# Altium schematic sheet Project 2.SchDoc
size Tabloid
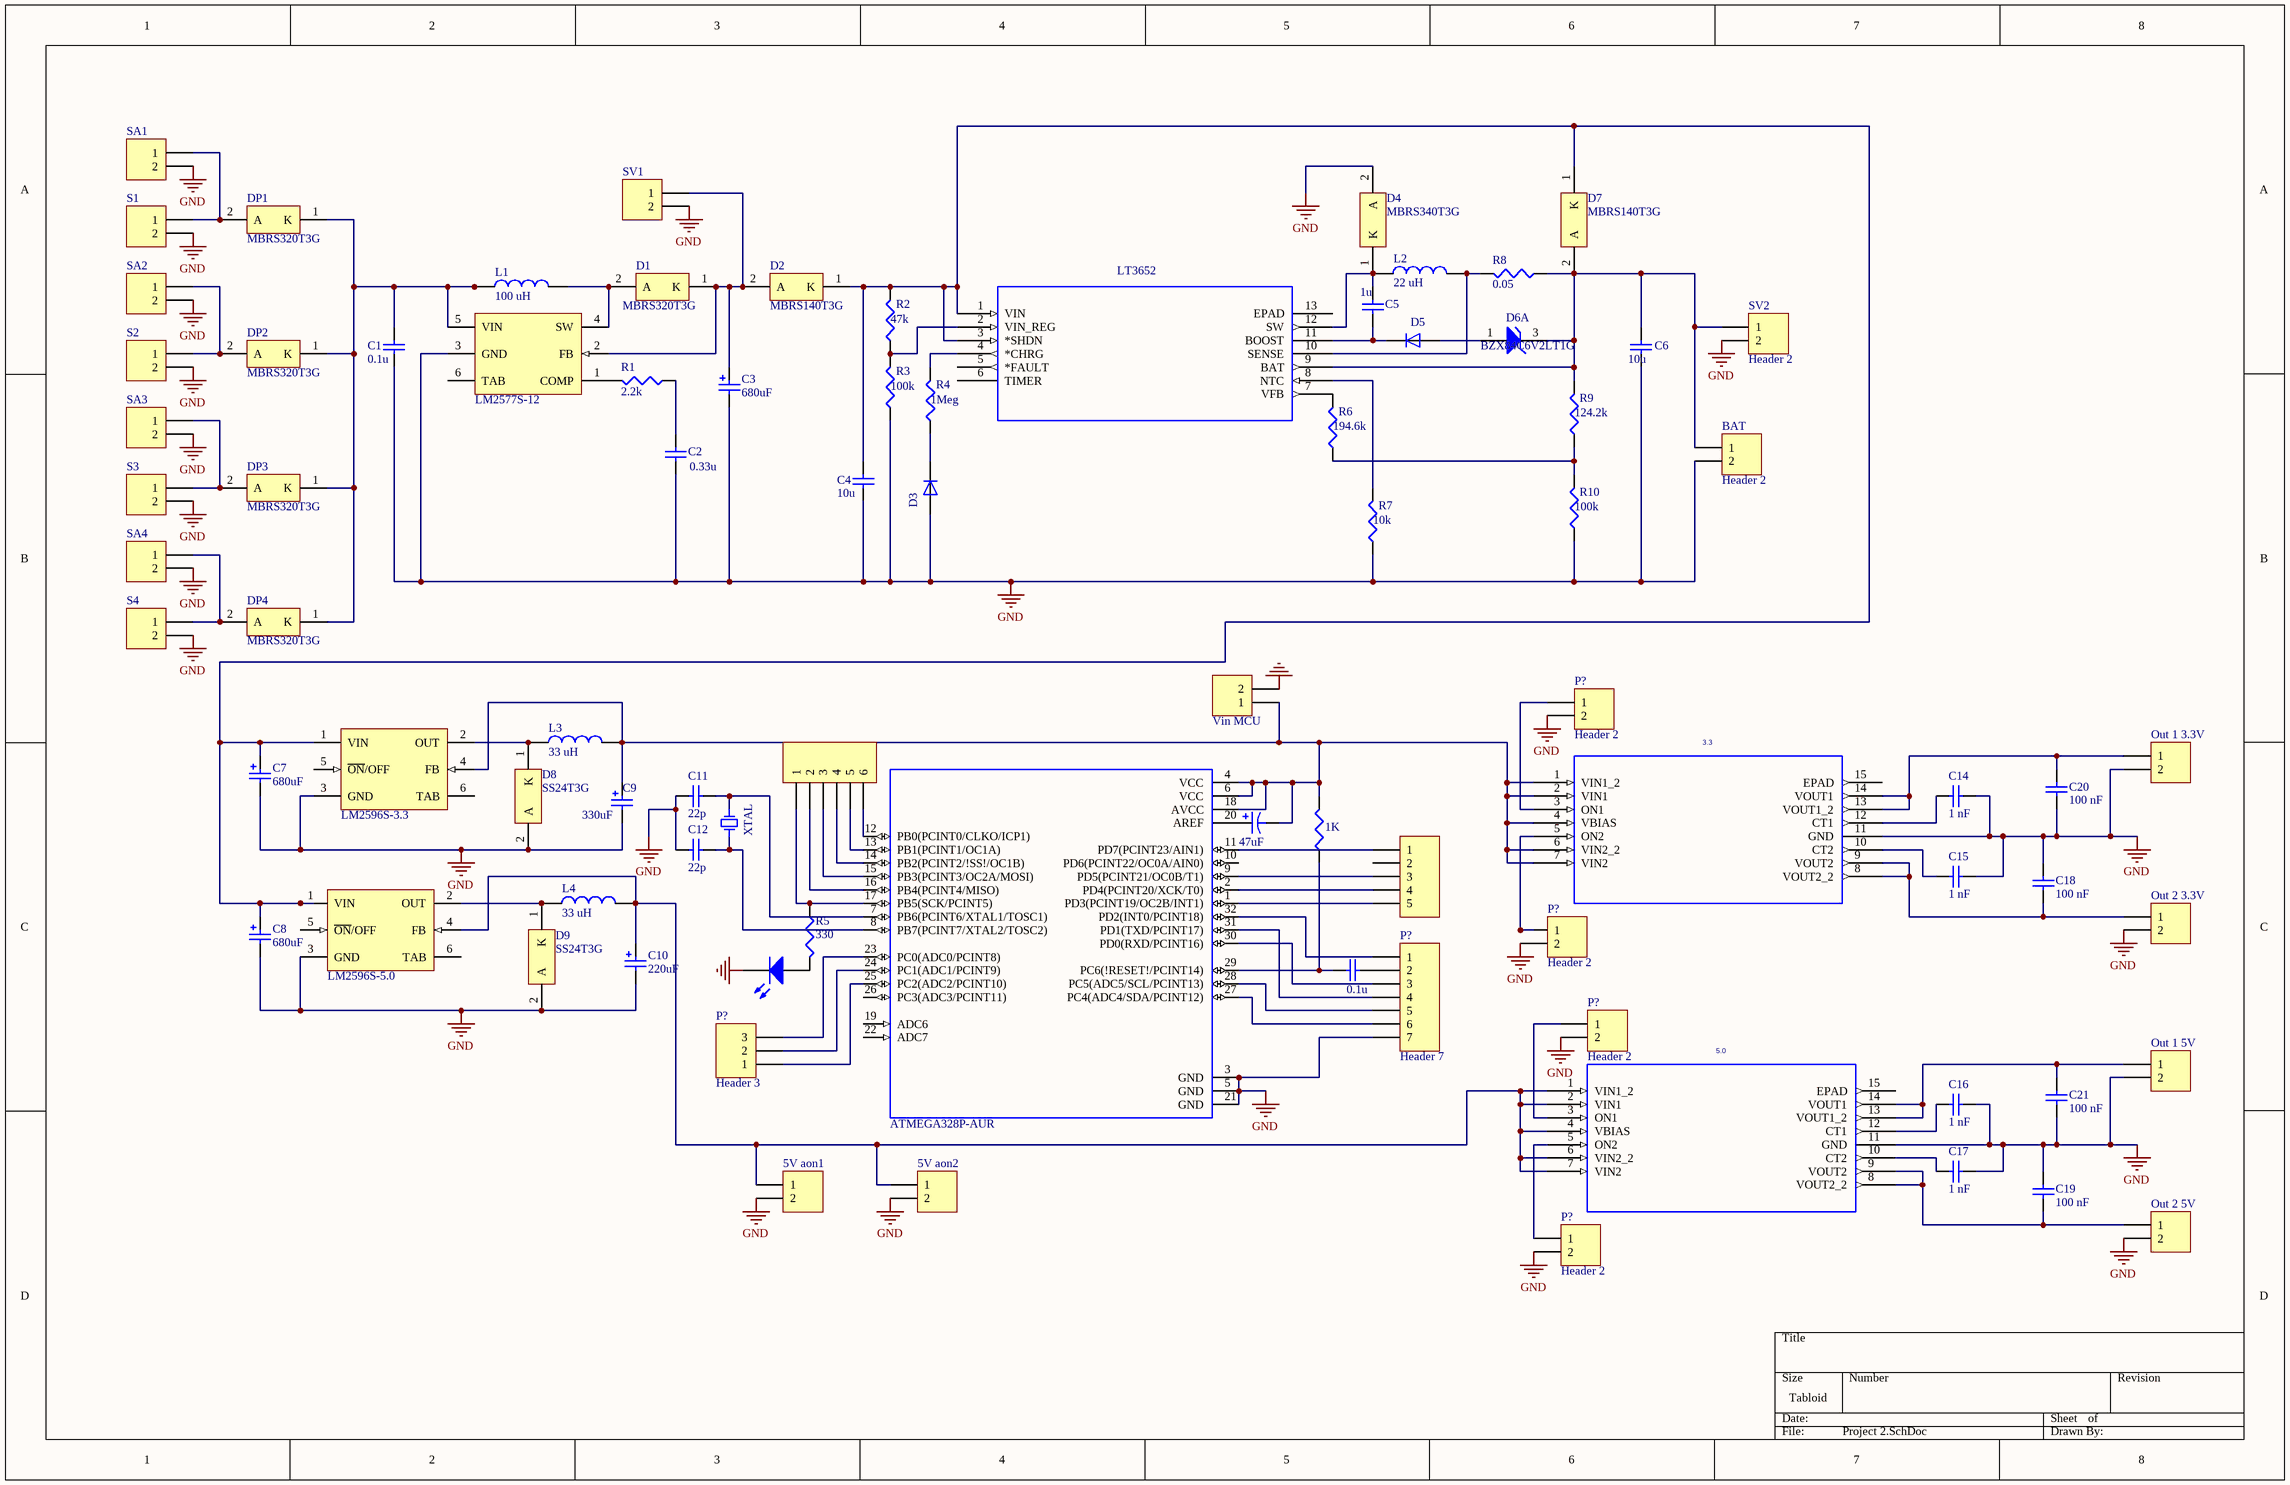
[diagram p0: Project 2.SchDoc]

## Parts
(Parts that share a designator on the sheet are numbered #1, #2 ... from top to bottom, then left to right.)
3.3  3.3  [DPU14_0P90X2P50]  (value not drawn)
5.0  TPS22966TDPURQ1  [DPU14_0P90X2P50]  (value not drawn)
5V_aon1  Header 2  [HDR1X2]  (value not drawn)
5V_aon2  Header 2  [HDR1X2]  (value not drawn)
?  LT3652  [MSOP-12_MSE]
BAT  Header 2  [HDR1X2]
C1  value 0.1u  [CAPC2512L]  (hidden comment: Cap Semi)
C2  value 0.33u  [CAPC2512L]  (hidden comment: Cap Semi)
C3  value 680uF  [WCAP-ASLL_10x10.5]  (hidden comment: 865060357010)
C4  value 10u  [CAPC3216L]  (hidden comment: Cap Semi)
C5  value 1u  [CAPC3216L]  (hidden comment: Cap Semi)
C6  value 10u  [CAPC3216L]  (hidden comment: Cap Semi)
C7  value 680uF  [WCAP-ASLL_8x10.5]  (hidden comment: 865060153009)
C8  value 680uF  [WCAP-ASLL_8x10.5]  (hidden comment: 865060153009)
C9  value 330uF  [WCAP-ASLL_6.3x7.7]  (hidden comment: 865060145006)
C10  value 220uF  [WCAP-ASLL_6.3x7.7]  (hidden comment: 865060145006)
C11  value 22p  [CAPC3216L]  (hidden comment: Cap Semi)
C12  value 22p  [CAPC3216L]  (hidden comment: Cap Semi)
C14  value 1 nF  [CAPC3216L]  (hidden comment: Cap Semi)
C15  value 1 nF  [CAPC3216L]  (hidden comment: Cap Semi)
C16  value 1 nF  [CAPC3216L]  (hidden comment: Cap Semi)
C17  value 1 nF  [CAPC3216L]  (hidden comment: Cap Semi)
C18  value 100 nF  [CAPC3216L]  (hidden comment: Cap Semi)
C19  value 100 nF  [CAPC3216L]  (hidden comment: Cap Semi)
C20  value 100 nF  [CAPC3216L]  (hidden comment: Cap Semi)
C21  value 100 nF  [CAPC3216L]  (hidden comment: Cap Semi)
C?#1  value 47uF  [CAPC4532L]  (hidden comment: Cap Pol3)
C?#2  value 0.1u  [CAPC3216L]  (hidden comment: Cap Semi)
D1  MBRS320T3G  [ONSC-SMC-2-403-03_V]
D2  MBRS140T3G  [ONSC-SMB-2-403A-03_H_V]
D3  1N4148X-TP  [CAPC3216L]  (value not drawn)
D4  MBRS340T3G  [ONSC-SMC-2-403-03_V]
D5  1N4148X-TP  [CAPC3216L]  (value not drawn)
D6  BZX84C6V2LT1G  [ONSC-SOT-23-3-318-08_V]  (part A of 2)
D7  MBRS140T3G  [ONSC-SMB-2-403A-03_H_V]
D8  SS24T3G  [ONSC-SMB-2-403A-03_V]
D9  SS24T3G  [ONSC-SMB-2-403A-03_V]
D10  LED  [DSO-F2/D6.1]  (value not drawn)
DP1  MBRS320T3G  [ONSC-SMC-2-403-03_V]
DP2  MBRS320T3G  [ONSC-SMC-2-403-03_V]
DP3  MBRS320T3G  [ONSC-SMC-2-403-03_V]
DP4  MBRS320T3G  [ONSC-SMC-2-403-03_V]
L1  100 uH  [WE-PD_1280_Metal base]
L2  22 uH  [WE-PD_1280_Metal base]
L3  33 uH  [WE-PD_1280_Metal base]
L4  33 uH  [WE-PD_1280_Metal base]
Out_1_3.3V  Header 2  [HDR1X2]  (value not drawn)
Out_1_5V  Header 2  [HDR1X2]  (value not drawn)
Out_2_3.3V  Header 2  [HDR1X2]  (value not drawn)
Out_2_5V  Header 2  [HDR1X2]  (value not drawn)
P?#1  Header 2  [HDR1X2]
P?#2  Vin MCU  [HDR1X2]
P?#3  Header 6  [HDR1X6]  (value not drawn)
P?#4  Header 5  [HDR1X5]  (value not drawn)
P?#5  Header 2  [HDR1X2]
P?#6  Header 7  [HDR1X7]
P?#7  Header 2  [HDR1X2]
P?#8  Header 3  [HDR1X3]
P?#9  Header 2  [HDR1X2]
R1  value 2.2k  [RESC1608L]  (hidden comment: Res3)
R2  value 47k  [RESC1608L]  (hidden comment: Res3)
R3  value 100k  [RESC1608L]  (hidden comment: Res3)
R4  value 1Meg  [RESC1608L]  (hidden comment: Res3)
R5  value 330  [RESC1608L]  (hidden comment: Res3)
R6  value 194.6k  [RESC1608L]  (hidden comment: Res3)
R7  value 10k  [RESC1608L]  (hidden comment: Res3)
R8  value 0.05  [RESC1608L]  (hidden comment: Res3)
R9  value 124.2k  [RESC1608L]  (hidden comment: Res3)
R10  value 100k  [RESC1608L]  (hidden comment: Res3)
R?  value 1K  [RESC1608L]  (hidden comment: Res3)
S1  Header 2  [HDR1X2]  (value not drawn)
S2  Header 2  [HDR1X2]  (value not drawn)
S3  Header 2  [HDR1X2]  (value not drawn)
S4  Header 2  [HDR1X2]  (value not drawn)
SA1  Header 2  [HDR1X2]  (value not drawn)
SA2  Header 2  [HDR1X2]  (value not drawn)
SA3  Header 2  [HDR1X2]  (value not drawn)
SA4  Header 2  [HDR1X2]  (value not drawn)
SV1  Header 2  [HDR1X2]  (value not drawn)
SV2  Header 2  [HDR1X2]
U1  LM2596S-5.0  [TS5B_N]
U2  LM2596S-3.3  [TS5B_N]
U3  LM2577S-12  [TS5B_N]
U4  ATMEGA328P-AUR  [QFP32P80_900X900X120L60X37N]
XTAL  LFXTAL003237  [XTAL1140X490X430N]  (value not drawn)

## Nets
GND: 3.3.11(GND) 5.0.11(GND) 5V_aon1.2 5V_aon2.2 BAT.2 C1.1 C2.1 C3.2(N) C4.1 C6.1 C7.2(N) C8.2(N) C9.2(N) C10.2(N) C11.2 C12.2 C14.1 C15.1 C16.1 C17.1 C18.1 C19.1 C20.2 C21.2 D3.A D4.2(A) D8.2(A) D9.2(A) D10.2(K) Out_1_3.3V.2 Out_1_5V.2 Out_2_3.3V.2 Out_2_5V.2 P?#1.2 P?#2.2 P?#5.2 P?#6.7 P?#7.2 P?#9.2 R3.1 R7.1 R10.1 S1.2 S2.2 S3.2 S4.2 SA1.2 SA2.2 SA3.2 SA4.2 SV1.2 SV2.2 U1.3(GND) U2.3(GND) U3.3(GND) U4.3(GND) U4.5(GND) U4.21(GND)
Net3.3_1: 3.3.1(VIN1_2) 3.3.2(VIN1) 3.3.4(VBIAS) 3.3.6(VIN2_2) 3.3.7(VIN2) C9.1(P) C?#1.2 L3.2 P?#2.1 R?.2 U2.4(FB) U4.4(VCC) U4.6(VCC) U4.18(AVCC)
Net3.3_3: 3.3.3(ON1) P?#1.1
Net3.3_5: 3.3.5(ON2) P?#5.1
Net3.3_8: 3.3.8(VOUT2_2) 3.3.9(VOUT2) C18.2 Out_2_3.3V.1
Net3.3_10: 3.3.10(CT2) C15.2
Net3.3_12: 3.3.12(CT1) C14.2
Net3.3_13: 3.3.13(VOUT1_2) 3.3.14(VOUT1) C20.1 Out_1_3.3V.1
Net5.0_1: 5.0.1(VIN1_2) 5.0.2(VIN1) 5.0.4(VBIAS) 5.0.6(VIN2_2) 5.0.7(VIN2) 5V_aon1.1 5V_aon2.1 C10.1(P) L4.2 U1.4(FB)
Net5.0_3: 5.0.3(ON1) P?#7.1
Net5.0_5: 5.0.5(ON2) P?#9.1
Net5.0_8: 5.0.8(VOUT2_2) 5.0.9(VOUT2) C19.2 Out_2_5V.1
Net5.0_10: 5.0.10(CT2) C17.2
Net5.0_12: 5.0.12(CT1) C16.2
Net5.0_13: 5.0.13(VOUT1_2) 5.0.14(VOUT1) C21.1 Out_1_5V.1
Net?_1: ?.1(VIN) ?.3(*SHDN) C4.2 C7.1(P) C8.1(P) D2.1(K) D7.1(K) R2.2 U1.1(VIN) U2.1(VIN)
Net?_2: ?.2(VIN_REG) R2.1 R3.2
Net?_4: ?.4(*CHRG) R4.2
Net?_7: ?.7(VFB) R6.2
Net?_8: ?.8(NTC) R7.2
Net?_9: ?.9(BAT) BAT.1 C6.2 D6.3(K) D7.2(A) R8.1 R9.2 SV2.1
Net?_10: ?.10(SENSE) L2.2 R8.2
Net?_11: ?.11(BOOST) C5.1 D5.C
Net?_12: ?.12(SW) C5.2 D4.1(K) L2.1
NetC1_2: C1.2 DP1.1(K) DP2.1(K) DP3.1(K) DP4.1(K) L1.1 U3.5(VIN)
NetC2_2: C2.2 R1.1
NetC3_1: C3.1(P) D1.1(K) D2.2(A) SV1.1 U3.2(FB)
NetC11_1: C11.1 U4.7(PB6(PCINT6/XTAL1/TOSC1)) XTAL.2
NetC12_1: C12.1 U4.8(PB7(PCINT7/XTAL2/TOSC2)) XTAL.1
NetC?#1_1: C?#1.1 U4.20(AREF)
NetC?#2_1: C?#2.1 R?.1 U4.29(PC6(!RESET!/PCINT14))
NetC?#2_2: C?#2.2 P?#6.2
NetD1_2: D1.2(A) L1.2 U3.4(SW)
NetD3_C: D3.C R4.1
NetD5_A: D5.A D6.1(A)
NetD8_1: D8.1(K) L3.1 U2.2(OUT)
NetD9_1: D9.1(K) L4.1 U1.2(OUT)
NetD10_1: D10.1(A) R5.2
NetDP1_2: DP1.2(A) S1.1 SA1.1
NetDP2_2: DP2.2(A) S2.1 SA2.1
NetDP3_2: DP3.2(A) S3.1 SA3.1
NetDP4_2: DP4.2(A) S4.1 SA4.1
NetP?#3_1: P?#3.1 R5.1 U4.17(PB5(SCK/PCINT5))
NetP?#3_2: P?#3.2 U4.16(PB4(PCINT4/MISO))
NetP?#3_3: P?#3.3 U4.15(PB3(PCINT3/OC2A/MOSI))
NetP?#3_4: P?#3.4 U4.14(PB2(PCINT2/!SS!/OC1B))
NetP?#3_5: P?#3.5 U4.13(PB1(PCINT1/OC1A))
NetP?#3_6: P?#3.6 U4.12(PB0(PCINT0/CLKO/ICP1))
NetP?#4_1: P?#4.1 U4.11(PD7(PCINT23/AIN1))
NetP?#4_3: P?#4.3 U4.9(PD5(PCINT21/OC0B/T1))
NetP?#4_4: P?#4.4 U4.2(PD4(PCINT20/XCK/T0))
NetP?#4_5: P?#4.5 U4.1(PD3(PCINT19/OC2B/INT1))
NetP?#6_1: P?#6.1 U4.32(PD2(INT0/PCINT18))
NetP?#6_3: P?#6.3 U4.30(PD0(RXD/PCINT16))
NetP?#6_4: P?#6.4 U4.31(PD1(TXD/PCINT17))
NetP?#6_5: P?#6.5 U4.28(PC5(ADC5/SCL/PCINT13))
NetP?#6_6: P?#6.6 U4.27(PC4(ADC4/SDA/PCINT12))
NetP?#8_1: P?#8.1 U4.25(PC2(ADC2/PCINT10))
NetP?#8_2: P?#8.2 U4.24(PC1(ADC1/PCINT9))
NetP?#8_3: P?#8.3 U4.23(PC0(ADC0/PCINT8))
NetR1_2: R1.2 U3.1(COMP)
NetR6_1: R6.1 R9.1 R10.2

Not connected (* = marked no-connect by the designer): 3.3 15(EPAD); 5.0 15(EPAD); ? 5(*FAULT) 6(TIMER) 13(EPAD); P?#4 2; U1 5(~{ON}/OFF) 6(TAB); U2 5(~{ON}/OFF) 6(TAB); U3 6(TAB); U4 10(PD6(PCINT22/OC0A/AIN0)) 19(ADC6) 22(ADC7) 26(PC3(ADC3/PCINT11))

## Library data of the parts
3.3 5.0 = TPS22966TDPURQ1: C: Copyright (C) 2015 Accelerated Designs. All rights reserved; Vendor: Texas Instruments; Built_By: EMA_UL_Team; Value: TPS22966TDPURQ1; Manufacturer_Part_Number: TPS22966TDPURQ1
5V_aon1 5V_aon2 BAT Out_1_3.3V Out_1_5V Out_2_3.3V Out_2_5V P?#1 P?#2 P?#5 P?#7 P?#9 S1-S4 SA1-SA4 SV1 SV2 = Header 2: Header, 2-Pin; LatestRevisionDate: 17-Jul-2002; LatestRevisionNote: Re-released for DXP Platform.; Publisher: Altium Limited
? = LT3652IMSETRPBF: LT3652 - Power Tracking 2A Battery Charger for Solar Power; MF: Linear Technology/Analog; MP: LT3652IMSE#TRPBF; Package: TSSOP-12 Linear Technology; Price: None; Availability: Unavailable; SnapEDA_Link: https://www.snapeda.com/parts/LT3652IMSE%23TRPBF/Linear%20Technology/Analog%20Devices/view-part/?ref=snap; Value: *
C1 C2 C4-C6 C11 C12 C14-C21 C?#2 = Cap Semi: Capacitor (Semiconductor SIM Model); Published: 8-Jun-2000; LatestRevisionDate: 29-May-2009; LatestRevisionNote: IPC-7351 Footprint Added.; PackageReference: C1206; Publisher: Altium Limited; PackageDescription: Chip Capacitor
C3 = 865060357010: WCAP-ASLL Aluminum Electrolytic Capacitors, size Ф10x10.5mm, 16V DC, 680uF; Rated Voltage: 16V DC; ComponentLink1Description: Manufacturer; ComponentLink1URL: http://www.we-online.de; ComponentLink2Description: Datasheet; ComponentLink2URL: http://katalog.we-online.de/pbs/datasheet/865060357010.pdf; Part Number: 865060357010; Published Date: June 2017; Publisher: Wurth Elektronik; Size: Ф10x10.5mm; Life Cycle: 5000h; Operating Temperature: -55 °C up to +105 °C
C7 C8 = 865060153009: WCAP-ASLL Aluminum Electrolytic Capacitors, size Ф8x10.5mm, 6.3V DC, 680uF; Rated Voltage: 6.3V DC; ComponentLink1Description: Manufacturer; ComponentLink1URL: http://www.we-online.de; ComponentLink2Description: Datasheet; ComponentLink2URL: http://katalog.we-online.de/pbs/datasheet/865060153009.pdf; Part Number: 865060153009; Published Date: June 2017; Publisher: Wurth Elektronik; Size: Ф8x10.5mm; Life Cycle: 5000h; Operating Temperature: -55 °C up to +105 °C
C9 C10 = 865060145006: WCAP-ASLL Aluminum Electrolytic Capacitors, size Ф6.3x7.7mm, 6.3V DC, 220uF; Rated Voltage: 6.3V DC; ComponentLink1Description: Manufacturer; ComponentLink1URL: http://www.we-online.de; ComponentLink2Description: Datasheet; ComponentLink2URL: http://katalog.we-online.de/pbs/datasheet/865060145006.pdf; Part Number: 865060145006; Published Date: June 2017; Publisher: Wurth Elektronik; Size: Ф6.3x7.7mm; Life Cycle: 2000h; Operating Temperature: -55 °C up to +105 °C
C?#1 = Cap Pol3: Polarized Capacitor (Surface Mount); Published: 8-Jun-2000; LatestRevisionDate: 29-May-2009; LatestRevisionNote: IPC-7351 Footprint Added.; PackageReference: C0805; Publisher: Altium Limited; PackageDescription: Chip Capacitor
D1 DP1-DP4 = MBRS320T3G: Schottky Power Rectifier, 2-Pin SMC, Pb-Free, Tape and Reel; Manufacturer: On Semiconductor; IFSM Max (A): 80; Configuration: Single; ComponentLink1Description: Manufacturer URL; ComponentLink2Description: Datasheet; PartNumber: MBRS320T3G; DatasheetVersion: Rev. 11; PackageReference: SMC-2-403-03; ComponentLink3URL: http://www.onsemi.com/pub_link/Collateral/403-03.PDF; ComponentLink3Description: Package Specification; ComponentLink1URL: http://www.onsemi.com/; Packing: Tape and Reel; PackageVersion: Rev. E, 08/2005; Mounting Technology: Surface Mount; PackageDescription: 2-Pin Small Molded Package, J-Bend Lead, Body 5.845 x 6.855 mm; ComponentLink2URL: http://www.onsemi.cn/pub_link/Collateral/MBRS340T3-D.PDF; RoHS: TRUE
D2 D7 = MBRS140T3G: Schottky Power Rectifier, 2-Pin SMB, Pb-Free, Tape and Reel; Manufacturer: On Semiconductor; IFSM Max (A): 40; Configuration: Single; ComponentLink1Description: Manufacturer URL; ComponentLink2Description: Datasheet; PartNumber: MBRS140T3G; DatasheetVersion: Rev. 9; PackageReference: SMB-2-403A-03_H; ComponentLink3URL: http://www.onsemi.com/pub_link/Collateral/1SMB5913BT3-D.PDF; ComponentLink3Description: Package Specification; ComponentLink1URL: http://www.onsemi.com/; ComponentLink2URL: http://www.onsemi.cn/pub_link/Collateral/MBRS140T3-D.PDF; Packing: Tape and Reel; Mounting Technology: Surface Mount; PackageDescription: 2-Pin Small Molded Package, J-Bend Lead, Body 4.33 x 3.625 mm; PackageVersion: Rev. H, 05/2011; RoHS: TRUE
D3 D5 = 1N4148X-TP: 1N4148X Series 100 V 300 mA 4 ns SMT High Speed Switching Diode - SOD-523; MF: Micro Commercial; MP: 1N4148X-TP; Price: None; Availability: Unavailable; SnapEDA_Link: https://www.snapeda.com/parts/1N4148X-TP/Micro%20Commercial/view-part/?ref=snap; Package: SOD-523 MCC; Value: *
D4 = MBRS340T3G: Schottky Power Rectifier, 2-Pin SMC, Pb-Free, Tape and Reel; Manufacturer: On Semiconductor; IFSM Max (A): 80; Configuration: Single; ComponentLink1Description: Manufacturer URL; ComponentLink2Description: Datasheet; DatasheetVersion: Rev. 11; ComponentLink3URL: http://www.onsemi.com/pub_link/Collateral/403-03.PDF; ComponentLink3Description: Package Specification; ComponentLink1URL: http://www.onsemi.com/; ComponentLink2URL: http://www.onsemi.cn/pub_link/Collateral/MBRS340T3-D.PDF; Packing: Tape and Reel; PackageVersion: Rev. E, 08/2005; PartNumber: MBRS340T3G; PackageDescription: 2-Pin Small Molded Package, J-Bend Lead, Body 5.845 x 6.855 mm; Mounting Technology: Surface Mount; RoHS: TRUE; PackageReference: SMC-2-403-03
D6 = BZX84C6V2LT1G: Zener Voltage Regulator, 225 mW, 3-Pin SOT-23, Pb-Free, Tape and Reel; Manufacturer: On Semiconductor; ComponentLink1Description: Manufacturer URL; ComponentLink2Description: Datasheet; ComponentLink3Description: Package Specification; Mounting Technology: Surface Mount; ComponentLink3URL: http://www.onsemi.cn/pub_link/Collateral/318-08.PDF; DatasheetVersion: Rev. 17; ComponentLink1URL: http://www.onsemi.com/; Packing: Tape and Reel; PackageVersion: Rev. AP, 11/2009; PartNumber: BZX84C6V2LT1G; PackageReference: SOT-23-3-318-08; PackageDescription: 3-Pin Small Outline Transistor, Body 2.92 x 1.3 mm, Pitch 0.95 mm; ComponentLink2URL: http://www.onsemi.com/pub_link/Collateral/BZX84C2V4LT1-D.PDF; RoHS: Pb-Free
D8 D9 = SS24T3G: Schottky Power Rectifier, 2-Pin SMB, Pb-Free, Tape and Reel; Manufacturer: On Semiconductor; IFSM Max (A): 75; Configuration: Single; ComponentLink1Description: Manufacturer URL; ComponentLink2Description: Datasheet; ComponentLink3Description: Package Specification; PackageReference: SMB-2-403A-03; ComponentLink3URL: http://www.onsemi.com/pub_link/Collateral/403A-03.PDF; DatasheetVersion: Rev. 4; ComponentLink1URL: http://www.onsemi.com/; ComponentLink2URL: http://www.onsemi.cn/pub_link/Collateral/SS24-D.PDF; Packing: Tape and Reel; PackageVersion: Rev. J, 07/2012; PartNumber: SS24T3G; PackageDescription: 2-Pin Small Molded Package, J-Bend Lead, Body 4.33 x 3.625 mm; Mounting Technology: Surface Mount; RoHS: TRUE
D10 = LED2: Typical RED, GREEN, YELLOW, AMBER GaAs LED; Published: 8-Jun-2000; LatestRevisionDate: 17-Jul-2002; LatestRevisionNote: Re-released for DXP Platform.; PackageVersion: Feb-2002; PackageReference: 3.2X1.6X1.1; Publisher: Altium Limited
L1 = 744770282: WE-PD SMT Shielded Power Inductor, size 1280, 820 uH, 0.6 A; Rated Current: 0.6 A; Inductance: 820 uH; DC Resistance max.: 1.64 Ohm; Self Resonant Frequency: 2 MHz; ComponentLink1Description: Manufacturer; ComponentLink1URL: http://www.we-online.de; ComponentLink2Description: Datasheet; ComponentLink2URL: https://katalog.we-online.de/pbs/datasheet/744770282.pdf; Part Number: 744770282; Published Date: September 2018; Publisher: Wurth Elektronik; Size: 1280; Operating Temperature: -40 to 125 degC; Mounting Technology: SMT; Packaging: Tape and Reel
L2 = 744770122: WE-PD SMT Shielded Power Inductor, size 1280, 22 uH, 4.1 A; Rated Current: 4.1 A; DC Resistance max.: 0.043 Ohm; Self Resonant Frequency: 12 MHz; ComponentLink1Description: Manufacturer; ComponentLink1URL: http://www.we-online.de; ComponentLink2Description: Datasheet; ComponentLink2URL: https://katalog.we-online.de/pbs/datasheet/744770122.pdf; Part Number: 744770122; Published Date: September 2018; Publisher: Wurth Elektronik; Size: 1280; Inductance: 22 uH; Operating Temperature: -40 to 125 degC; Mounting Technology: SMT; Packaging: Tape and Reel
L3 L4 = 744770133: WE-PD SMT Shielded Power Inductor, size 1280, 33 uH, 3.2 A; Rated Current: 3.2 A; DC Resistance max.: 0.064 Ohm; Self Resonant Frequency: 8.5 MHz; ComponentLink1Description: Manufacturer; ComponentLink1URL: http://www.we-online.de; ComponentLink2Description: Datasheet; ComponentLink2URL: https://katalog.we-online.de/pbs/datasheet/744770133.pdf; Part Number: 744770133; Published Date: September 2018; Publisher: Wurth Elektronik; Size: 1280; Inductance: 33 uH; Operating Temperature: -40 to 125 degC; Mounting Technology: SMT; Packaging: Tape and Reel
P?#3 = Header 6: Header, 6-Pin; LatestRevisionDate: 17-Jul-2002; LatestRevisionNote: Re-released for DXP Platform.; Publisher: Altium Limited
P?#4 = Header 5: Header, 5-Pin; LatestRevisionDate: 17-Jul-2002; LatestRevisionNote: Re-released for DXP Platform.; Publisher: Altium Limited
P?#6 = Header 7: Header, 7-Pin; LatestRevisionDate: 17-Jul-2002; LatestRevisionNote: Re-released for DXP Platform.; Publisher: Altium Limited
P?#8 = Header 3: Header, 3-Pin; LatestRevisionDate: 17-Jul-2002; LatestRevisionNote: Re-released for DXP Platform.; Publisher: Altium Limited
R1-R10 R? = Res3: Resistor; Published: 8-Jun-2000; LatestRevisionDate: 29-May-2009; LatestRevisionNote: IPC-7351 Footprint Added.; PackageReference: J1-0603; Publisher: Altium Limited; PackageDescription: Chip Resistor
U1 = LM2596S-5.0: SIMPLE SWITCHER Power Converter 150 KHz 3A Step-Down Voltage Regulator; Manufacturer: National Semiconductor; PackageTopMarking: NSUZXYTT*LM2596S*-5.0 P+; PowerWise: N; FirstPublished: 4-Dec-2008; DatasheetVersion: May-2002; PackageVersion: revD, Apr-2005; PackageReference: TS5B; Publisher: Altium Limited; PackageDescription: TO-263, Molded, .400 x .390 x .180in, 5 Lead, .067in Pitch, Surface Mount; CompType: Switcher; PartNumber: LM2596S-5.0; RoHS: O; PinCount: 5; DigiKeyPartNumber: LM2596S-5.0-ND; Code_JEDEC: MO-169-AB; ComponentLink1Description: LM2596 Datasheet; ComponentLink1URL: http://www.national.com/ds/LM/LM2596.pdf; ComponentLink2Description: LM2596 Web Page; ComponentLink2URL: http://www.national.com/pf/LM/LM2596.html; ComponentLink3Description: TS5B Package Page; ComponentLink3URL: http://www.national.com/packaging/folders/ts5b.html
U2 = LM2596S-3.3: SIMPLE SWITCHER Power Converter 150 KHz 3A Step-Down Voltage Regulator; Manufacturer: National Semiconductor; PackageTopMarking: NSUZXYTT*LM2596S*-3.3 P+; PowerWise: N; FirstPublished: 4-Dec-2008; DatasheetVersion: May-2002; PackageVersion: revD, Apr-2005; PackageReference: TS5B; Publisher: Altium Limited; PackageDescription: TO-263, Molded, .400 x .390 x .180in, 5 Lead, .067in Pitch, Surface Mount; CompType: Switcher; PartNumber: LM2596S-3.3; RoHS: O; PinCount: 5; DigiKeyPartNumber: LM2596S-3.3-ND; Code_JEDEC: MO-169-AB; ComponentLink1Description: LM2596 Datasheet; ComponentLink1URL: http://www.national.com/ds/LM/LM2596.pdf; ComponentLink2Description: LM2596 Web Page; ComponentLink2URL: http://www.national.com/pf/LM/LM2596.html; ComponentLink3Description: TS5B Package Page; ComponentLink3URL: http://www.national.com/packaging/folders/ts5b.html
U3 = LM2577S-12: SIMPLE SWITCHER; Step-Up Voltage Regulator; Manufacturer: National Semiconductor; PackageTopMarking: NSUZXYTT*LM2577S*-12 P+; PowerWise: N; FirstPublished: 4-Dec-2008; DatasheetVersion: Apr-2005; PackageVersion: revD, Apr-2005; PackageReference: TS5B; Publisher: Altium Limited; PackageDescription: TO-263, Molded, .400 x .390 x .180in, 5 Lead, .067in Pitch, Surface Mount; CompType: Switcher; PartNumber: LM2577S-12; RoHS: Y; PinCount: 5; DigiKeyPartNumber: LM2577S-12-ND; Code_JEDEC: MO-169-AB; ComponentLink1Description: LM2577 Datasheet; ComponentLink1URL: http://www.national.com/ds/LM/LM2577.pdf; ComponentLink2Description: LM2577 Web Page; ComponentLink2URL: http://www.national.com/pf/LM/LM2577.html; ComponentLink3Description: TS5B Package Page; ComponentLink3URL: http://www.national.com/packaging/folders/ts5b.html
U4 = ATMEGA328P-AUR: ATmega328P Series 8 Bit 2 kB RAM 32 kB Flash SMT Microcontroller - TQFP-32; MF: Microchip; Package: TQFP-32 Microchip; MP: ATMEGA328P-AUR; Price: None; Availability: Unavailable; SnapEDA_Link: https://www.snapeda.com/parts/ATMEGA328P-AUR/Microchip/view-part/?ref=snap; Value: *
XTAL = LFXTAL003237: HC49/4HSMX Series 16.000 MHz ±30 ppm 16 pF Low Profile Surface Mount Crystal; MF: IQD Frequency Products; Price: None; SnapEDA_Link: https://www.snapeda.com/parts/LFXTAL003237/IQD%20Frequency%20Products/view-part/?ref=snap; MP: LFXTAL003237; Package: None; Availability: Unavailable; Value: *